# Altium project BuckConverter.PrjPcb
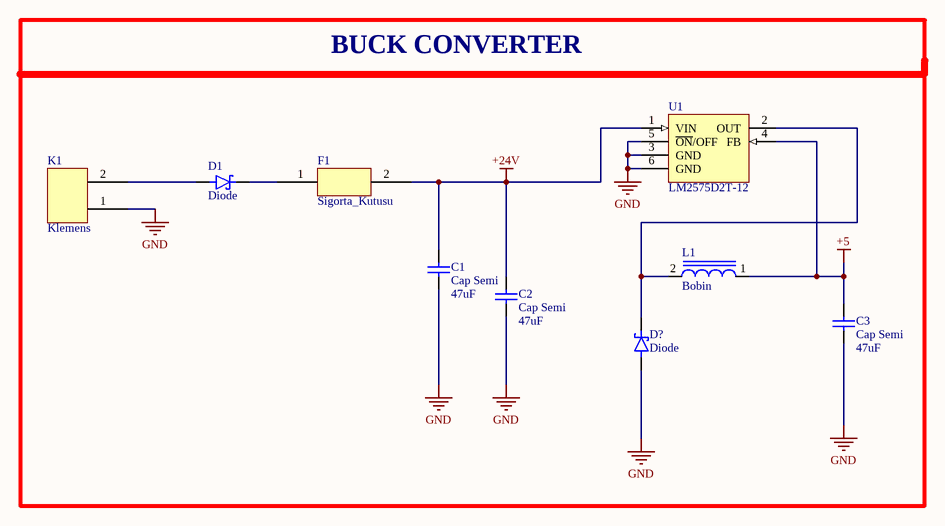
[diagram p0: Schematic.SchDoc]
1 sheet, 9 parts. Net scope: global (net labels, ports and power ports of the same name join across sheets).
Board files: BuckConverter.PcbDoc, BuckConverter_M.PcbDoc

## Sheet Schematic.SchDoc: Buck Converter by. glnd
size A4

### Parts
C1  Cap Semi  value 47uF  [C1206]
C2  Cap Semi  value 47uF  [C1206]
C3  Cap Semi  value 47uF  [C1206]
D1  Diode  [Diode]
D?  Diode  [Diode]
F1  Sigorta_Kutusu  [Sigorta_Kutusu]
K1  Klemens  [Klemens]
L1  Bobin  [Bobin]
U1  LM2575D2T-12  [936A-02]

### Nets
+5: C3.2 L1.1 U1.4(FB)
+24V: C1.2 C2.2 F1.2 U1.1(VIN)
GND: C1.1 C2.1 C3.1 D?.A K1.1 U1.3(GND) U1.5(~{ON}/OFF) U1.6(GND)
NetD1_A: D1.A K1.2
NetD1_C: D1.C F1.1
NetD?_C: D?.C L1.2 U1.2(OUT)

### Notes on the sheet
- BUCK CONVERTER
- Title
- Size:
- Date:
- A4
- Number:
- Time:
- Revision:
- Sheet
- of
- File:

### Library data of the parts
C1-C3 = Cap Semi: Capacitor (Semiconductor SIM Model); Published: 8-Jun-2000; LatestRevisionDate: 29-May-2009; LatestRevisionNote: IPC-7351 Footprint Added.; PackageReference: C1206; Publisher: Altium Limited; PackageDescription: Chip Capacitor
U1 = LM2575D2T-12: Easy Switcher 1.0A Step-Down Voltage Regulator; Note: Pin 3 is electrically connected to Pin 6;Pin 6 is heatsink; Published: 15-Apr-2002; DatasheetVersion: Jul-1999; PackageVersion: Jul-1999; PackageReference: 936A-02; Publisher: Altium Limited; PackageDescription: D2-PAK; 5 Leads; Body 14.7 (inc. leads) x 10.2 mm (LxW max); ComponentLink1Description: Manufacturer Link; ComponentLink1URL: http://www.onsemi.com/site/products/taxonomy/0,4438,503,00.html; ComponentLink2Description: Datasheet; ComponentLink2URL: http://www.onsemi.com/pub/Collateral/LM2575-D.PDF